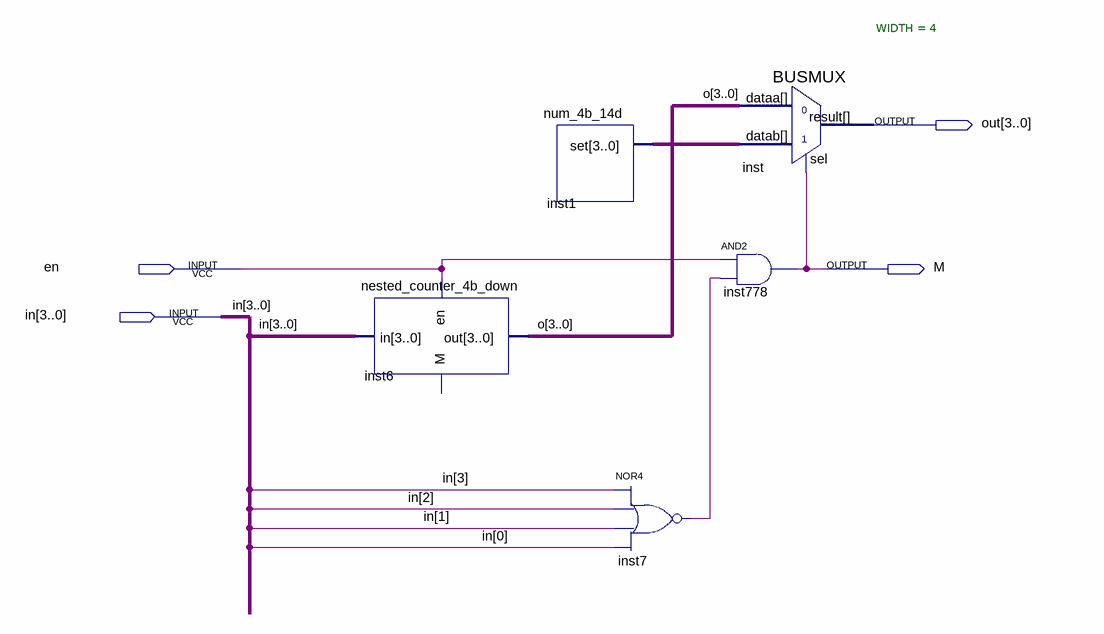
[diagram p0: schematic sheet]
// Quartus schematic nested_counter_15d_down.bdf as structural Verilog: 5 symbols, 4 pins
module nested_counter_15d_down (
  input  en,
  input  [3:0] in,
  output [3:0] out,
  output M
);

  wire inst7_out;
  wire [3:0] inst1_set, o;

  nested_counter_4b_down inst6 (.en(en), .in(in), .out(o));  // open: M
  num_4b_14d inst1 (.set(inst1_set));
  nor inst7 (inst7_out, in[3], in[2], in[1], in[0]);
  and inst778 (M, en, inst7_out);
  BUSMUX #(.WIDTH(4)) inst (.datab(inst1_set), .sel(M), .dataa(o), .result(out));
endmodule
